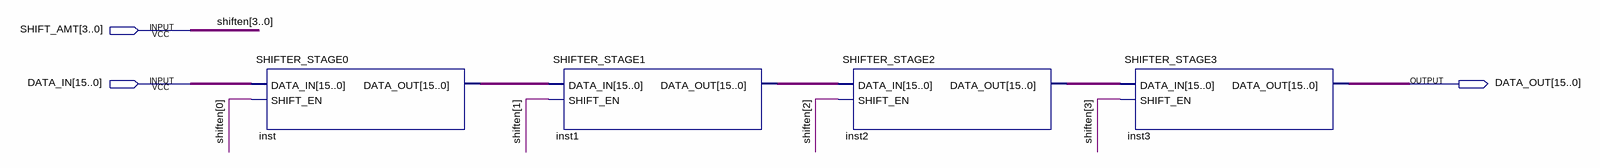
[diagram p0: schematic sheet]
// Quartus schematic BARREL_SHIFTER.bdf as structural Verilog: 4 symbols, 3 pins
module BARREL_SHIFTER (
  input  [3:0] SHIFT_AMT,
  input  [15:0] DATA_IN,
  output [15:0] DATA_OUT
);

  wire [15:0] inst1_data_out, inst2_data_out, inst_data_out;

  SHIFTER_STAGE0 inst (.DATA_IN(DATA_IN), .SHIFT_EN(SHIFT_AMT[0]), .DATA_OUT(inst_data_out));
  SHIFTER_STAGE1 inst1 (.DATA_IN(inst_data_out), .SHIFT_EN(SHIFT_AMT[1]), .DATA_OUT(inst1_data_out));
  SHIFTER_STAGE2 inst2 (.DATA_IN(inst1_data_out), .SHIFT_EN(SHIFT_AMT[2]), .DATA_OUT(inst2_data_out));
  SHIFTER_STAGE3 inst3 (.DATA_IN(inst2_data_out), .SHIFT_EN(SHIFT_AMT[3]), .DATA_OUT(DATA_OUT));

  // Other names for the same wires on the sheet: shiften[3:0] = SHIFT_AMT
endmodule
